# Altium project ST_TOF_Delays.PrjPCB
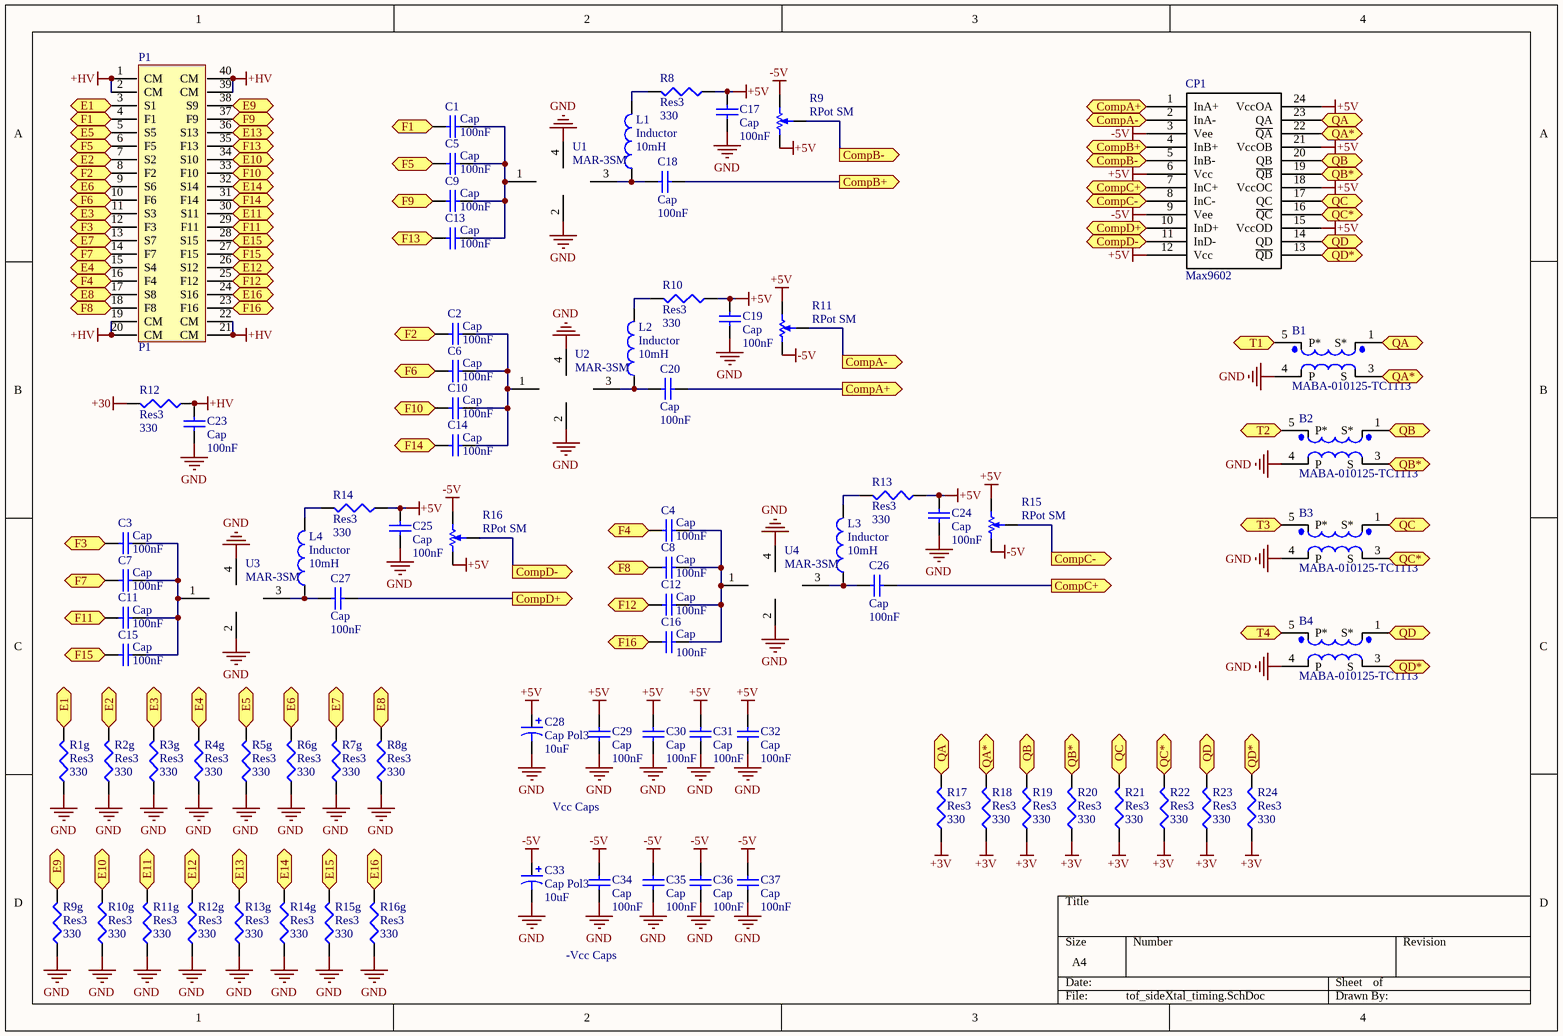
[diagram p0: tof_sideXtal_timing.SchDoc]
4 sheets, 240 parts. Net scope: flat (ports and power ports of the same name join across sheets).
Board file: tof_sideXtal_gnd_relief.PcbDoc
Sheets:
  tof_sideXtal_timing.SchDoc
  tof_sideXtal_timing2.SchDoc
  to_sideXtal_energy.SchDoc
  to_sideXtal_energy_delays.SchDoc

## Sheet tof_sideXtal_timing.SchDoc
size A4

### Parts
B1  MABA-010125-TC1113  [SM-22]
B2  MABA-010125-TC1113  [SM-22]
B3  MABA-010125-TC1113  [SM-22]
B4  MABA-010125-TC1113  [SM-22]
C1  Cap  value 100nF  [J1-0603]
C2  Cap  value 100nF  [J1-0603]
C3  Cap  value 100nF  [J1-0603]
C4  Cap  value 100nF  [J1-0603]
C5  Cap  value 100nF  [J1-0603]
C6  Cap  value 100nF  [J1-0603]
C7  Cap  value 100nF  [J1-0603]
C8  Cap  value 100nF  [J1-0603]
C9  Cap  value 100nF  [J1-0603]
C10  Cap  value 100nF  [J1-0603]
C11  Cap  value 100nF  [J1-0603]
C12  Cap  value 100nF  [J1-0603]
C13  Cap  value 100nF  [J1-0603]
C14  Cap  value 100nF  [J1-0603]
C15  Cap  value 100nF  [J1-0603]
C16  Cap  value 100nF  [J1-0603]
C17  Cap  value 100nF  [J1-0603]
C18  Cap  value 100nF  [J1-0603]
C19  Cap  value 100nF  [J1-0603]
C20  Cap  value 100nF  [J1-0603]
C23  Cap  value 100nF  [J1-0603]
C24  Cap  value 100nF  [J1-0603]
C25  Cap  value 100nF  [J1-0603]
C26  Cap  value 100nF  [J1-0603]
C27  Cap  value 100nF  [J1-0603]
C28  Cap Pol3  value 10uF  [J1-0603]
C29  Cap  value 100nF  [0402]
C30  Cap  value 100nF  [0402]
C31  Cap  value 100nF  [0402]
C32  Cap  value 100nF  [0402]
C33  Cap Pol3  value 10uF  [J1-0603]
C34  Cap  value 100nF  [0402]
C35  Cap  value 100nF  [0402]
C36  Cap  value 100nF  [0402]
C37  Cap  value 100nF  [0402]
CP1  Max9602  [TSSOP24]
L1  Inductor  value 10mH  [J1-0603]
L2  Inductor  value 10mH  [J1-0603]
L3  Inductor  value 10mH  [J1-0603]
L4  Inductor  value 10mH  [J1-0603]
P1  P1  [DS17(3.0)-40DS-0.5(0.57)]
R1g  Res3  value 330  [0402]
R2g  Res3  value 330  [0402]
R3g  Res3  value 330  [0402]
R4g  Res3  value 330  [0402]
R5g  Res3  value 330  [0402]
R6g  Res3  value 330  [0402]
R7g  Res3  value 330  [0402]
R8  Res3  value 330  [J1-0603]
R8g  Res3  value 330  [0402]
R9  RPot SM  [POT-3MM-SMD]
R9g  Res3  value 330  [0402]
R10  Res3  value 330  [J1-0603]
R10g  Res3  value 330  [0402]
R11  RPot SM  [POT-3MM-SMD]
R11g  Res3  value 330  [0402]
R12  Res3  value 330  [0402]
R12g  Res3  value 330  [0402]
R13  Res3  value 330  [J1-0603]
R13g  Res3  value 330  [0402]
R14  Res3  value 330  [J1-0603]
R14g  Res3  value 330  [0402]
R15  RPot SM  [POT-3MM-SMD]
R15g  Res3  value 330  [0402]
R16  RPot SM  [POT-3MM-SMD]
R16g  Res3  value 330  [0402]
R17  Res3  value 330  [0402]
R18  Res3  value 330  [0402]
R19  Res3  value 330  [0402]
R20  Res3  value 330  [0402]
R21  Res3  value 330  [0402]
R22  Res3  value 330  [0402]
R23  Res3  value 330  [0402]
R24  Res3  value 330  [0402]
U1  MAR-3SM  [WW107]
U2  MAR-3SM  [WW107]
U3  MAR-3SM  [WW107]
U4  MAR-3SM  [WW107]

### Ports
CompA+ (out), CompA- (out), CompB+ (out), CompB- (out), CompC+ (out), CompC- (out), CompD+ (out), CompD- (out), E1 (out), E2 (out), E3 (out), E4 (out), E5 (out), E6 (out), E7 (out), E8 (out), E9 (out), E10 (out), E11 (out), E12 (out), E13 (out), E14 (out), E15 (out), E16 (out), F1 (out), F2 (out), F3 (out), F4 (out), F5 (out), F6 (out), F7 (out), F8 (out), F9 (out), F10 (out), F11 (out), F12 (out), F13 (out), F14 (out), F15 (out), F16 (out), QA (out), QA* (out), QB (out), QB* (out), QC (out), QC* (out), QD (out), QD* (out), T1 (out), T2 (out), T3 (out), T4 (out)

### Nets
+3V: R17.1 R18.1 R19.1 R20.1 R21.1 R22.1 R23.1 R24.1
+5V: C17.1 C19.1 C24.1 C25.1 C28.1 C29.2 C30.2 C31.2 C32.2 CP1.6(Vcc) CP1.12(Vcc) CP1.15(VccOD) CP1.18(VccOC) CP1.21(VccOB) CP1.24(VccOA) R8.1 R9.CCW(-) R10.1 R11.CW(+) R13.1 R14.1 R15.CW(+) R16.CCW(-)
+30: R12.2
+HV: C23.1 P1.1(CM) P1.2(CM) P1.19(CM) P1.20(CM) P1.21(CM) P1.22(CM) P1.39(CM) P1.40(CM) R12.1
-5V: C33.1 C34.2 C35.2 C36.2 C37.2 CP1.3(Vee) CP1.9(Vee) R9.CW(+) R11.CCW(-) R15.CCW(-) R16.CW(+)
GND: B1.4(P) B2.4(P) B3.4(P) B4.4(P) C17.2 C19.2 C23.2 C24.2 C25.2 C28.2 C29.1 C30.1 C31.1 C32.1 C33.2 C34.1 C35.1 C36.1 C37.1 R1g.1 R2g.1 R3g.1 R4g.1 R5g.1 R6g.1 R7g.1 R8g.1 R9g.1 R10g.1 R11g.1 R12g.1 R13g.1 R14g.1 R15g.1 R16g.1 U1.2 U1.4 U2.2 U2.4 U3.2 U3.4 U4.2 U4.4
NetB1_1: B1.1(S*) CP1.23(QA) R17.2 ; port QA
NetB1_3: B1.3(S) CP1.22(~{QA}) R18.2 ; port QA*
NetB1_5: B1.5(P*) ; port T1
NetB2_1: B2.1(S*) CP1.20(QB) R19.2 ; port QB
NetB2_3: B2.3(S) CP1.19(~{QB}) R20.2 ; port QB*
NetB2_5: B2.5(P*) ; port T2
NetB3_1: B3.1(S*) CP1.17(QC) R21.2 ; port QC
NetB3_3: B3.3(S) CP1.16(~{QC}) R22.2 ; port QC*
NetB3_5: B3.5(P*) ; port T3
NetB4_1: B4.1(S*) CP1.14(QD) R23.2 ; port QD
NetB4_3: B4.3(S) CP1.13(~{QD}) R24.2 ; port QD*
NetB4_5: B4.5(P*) ; port T4
NetC1_1: C1.1 C5.1 C9.1 C13.1 U1.1
NetC1_2: C1.2 P1.4(F1) ; port F1
NetC2_1: C2.1 C6.1 C10.1 C14.1 U2.1
NetC2_2: C2.2 P1.8(F2) ; port F2
NetC3_1: C3.1 C7.1 C11.1 C15.1 U3.1
NetC3_2: C3.2 P1.12(F3) ; port F3
NetC4_1: C4.1 C8.1 C12.1 C16.1 U4.1
NetC4_2: C4.2 P1.16(F4) ; port F4
NetC5_2: C5.2 P1.6(F5) ; port F5
NetC6_2: C6.2 P1.10(F6) ; port F6
NetC7_2: C7.2 P1.14(F7) ; port F7
NetC8_2: C8.2 P1.18(F8) ; port F8
NetC9_2: C9.2 P1.37(F9) ; port F9
NetC10_2: C10.2 P1.33(F10) ; port F10
NetC11_2: C11.2 P1.29(F11) ; port F11
NetC12_2: C12.2 P1.25(F12) ; port F12
NetC13_2: C13.2 P1.35(F13) ; port F13
NetC14_2: C14.2 P1.31(F14) ; port F14
NetC15_2: C15.2 P1.27(F15) ; port F15
NetC16_2: C16.2 P1.23(F16) ; port F16
NetC18_1: C18.1 L1.1 U1.3
NetC18_2: C18.2 CP1.4(InB+) ; port CompB+
NetC20_1: C20.1 L2.1 U2.3
NetC20_2: C20.2 CP1.1(InA+) ; port CompA+
NetC26_1: C26.1 L3.1 U4.3
NetC26_2: C26.2 CP1.7(InC+) ; port CompC+
NetC27_1: C27.1 L4.1 U3.3
NetC27_2: C27.2 CP1.10(InD+) ; port CompD+
NetCP1_2: CP1.2(InA-) R11.W ; port CompA-
NetCP1_5: CP1.5(InB-) R9.W ; port CompB-
NetCP1_8: CP1.8(InC-) R15.W ; port CompC-
NetCP1_11: CP1.11(InD-) R16.W ; port CompD-
NetL1_2: L1.2 R8.2
NetL2_2: L2.2 R10.2
NetL3_2: L3.2 R13.2
NetL4_2: L4.2 R14.2
NetP1_3: P1.3(S1) R1g.2 ; port E1
NetP1_5: P1.5(S5) R5g.2 ; port E5
NetP1_7: P1.7(S2) R2g.2 ; port E2
NetP1_9: P1.9(S6) R6g.2 ; port E6
NetP1_11: P1.11(S3) R3g.2 ; port E3
NetP1_13: P1.13(S7) R7g.2 ; port E7
NetP1_15: P1.15(S4) R4g.2 ; port E4
NetP1_17: P1.17(S8) R8g.2 ; port E8
NetP1_24: P1.24(S16) R16g.2 ; port E16
NetP1_26: P1.26(S12) R12g.2 ; port E12
NetP1_28: P1.28(S15) R15g.2 ; port E15
NetP1_30: P1.30(S11) R11g.2 ; port E11
NetP1_32: P1.32(S14) R14g.2 ; port E14
NetP1_34: P1.34(S10) R10g.2 ; port E10
NetP1_36: P1.36(S13) R13g.2 ; port E13
NetP1_38: P1.38(S9) R9g.2 ; port E9

### Notes on the sheet
- Vcc Caps
- -Vcc Caps

### Library data of the parts
C1-C20 C23-C27 C29-C32 C34-C37 = Cap: Capacitor; Published: 8-Jun-2000; LatestRevisionDate: 17-Jul-2002; LatestRevisionNote: Re-released for DXP Platform.; PackageReference: RAD-0.3; Publisher: Altium Limited; PackageDescription: Radial Cap, Thru-Hole; 2 Leads; 0.3 in Pin Spacing
C28 C33 = Cap Pol3: Polarized Capacitor (Surface Mount); Published: 8-Jun-2000; LatestRevisionDate: 29-May-2009; LatestRevisionNote: IPC-7351 Footprint Added.; PackageReference: C0805; Publisher: Altium Limited; PackageDescription: Chip Capacitor
L1-L4 = Inductor: Code_IEC: 1005; Published: 8-Jun-2000; LatestRevisionDate: 29-May-2009; LatestRevisionNote: IPC-7351 Footprint Added.; PackageReference: 0402-A; Publisher: Altium Limited; PackageDescription: Chip Inductor; Code_JEITA: 0402
P1 = Sensl-ArrayC-30035-16P-PCB
R1g R2g R3g R4g R5g R6g R7g R8 R8g R9g R10 R10g R11g R12 R12g R13 R13g R14 R14g R15g R16g R17-R24 = Res3: Resistor; Published: 8-Jun-2000; LatestRevisionDate: 29-May-2009; LatestRevisionNote: IPC-7351 Footprint Added.; PackageReference: J1-0603; Publisher: Altium Limited; PackageDescription: Chip Resistor
R9 R11 R15 R16 = RPot SM: Square Trimming Potentiometer; Published: 17-Dec-2003; DatasheetVersion: Oct-2003; PackageReference: POT4MM-2; Publisher: Altium Limited; PackageDescription: Square Trimming Potentiometer; ComponentLink1Description: Manufacturer Link; ComponentLink1URL: http://bourns.com/2/search.html
U1-U4 = MAR-3SM+

## Sheet tof_sideXtal_timing2.SchDoc
size A4
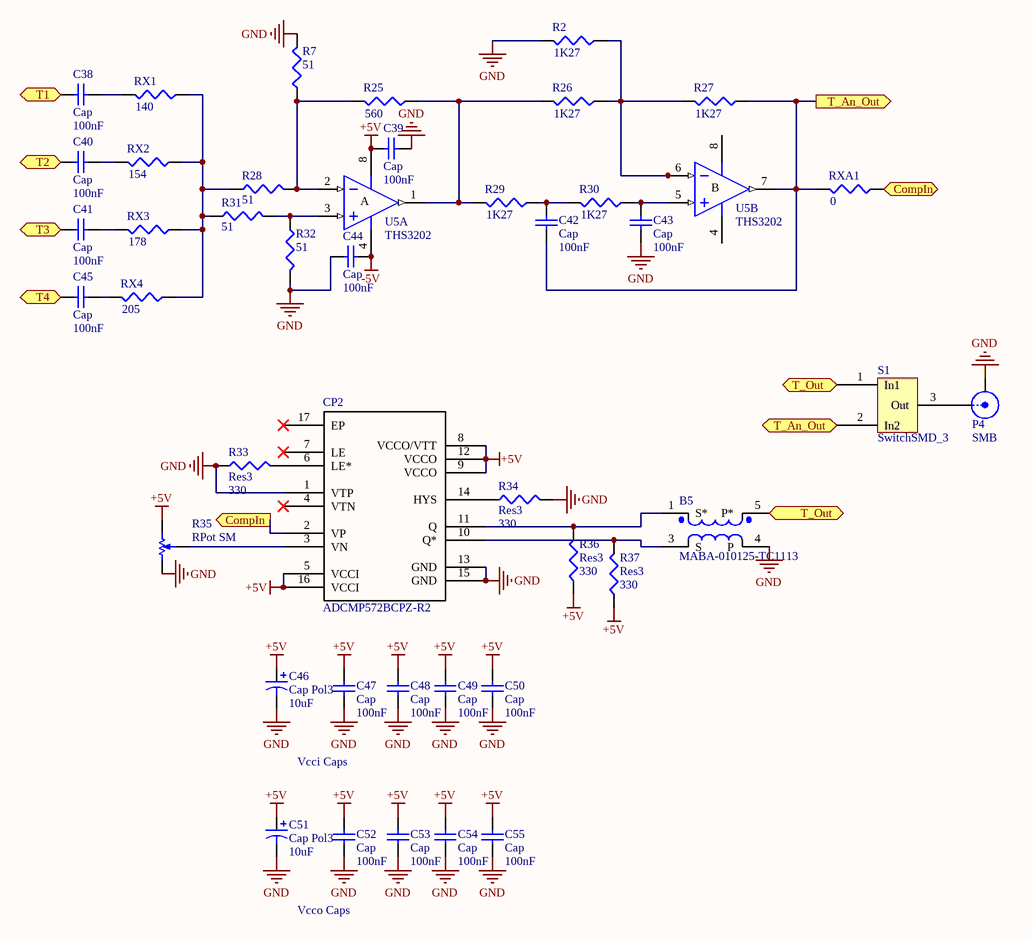
[diagram p1: tof_sideXtal_timing2.SchDoc]

### Parts
B5  MABA-010125-TC1113  [SM-22]
C38  Cap  value 100nF  [0402]
C39  Cap  value 100nF  [0402]
C40  Cap  value 100nF  [0402]
C41  Cap  value 100nF  [0402]
C42  Cap  value 100nF  [0402]
C43  Cap  value 100nF  [0402]
C44  Cap  value 100nF  [0402]
C45  Cap  value 100nF  [0402]
C46  Cap Pol3  value 10uF  [1608[0603]]
C47  Cap  value 100nF  [0402]
C48  Cap  value 100nF  [0402]
C49  Cap  value 100nF  [0402]
C50  Cap  value 100nF  [0402]
C51  Cap Pol3  value 10uF  [1608[0603]]
C52  Cap  value 100nF  [0402]
C53  Cap  value 100nF  [0402]
C54  Cap  value 100nF  [0402]
C55  Cap  value 100nF  [0402]
CP2  ADCMP572BCPZ-R2  [CP_16_3]
P4  SMB  [SMA-SMD]
R2  value 1K27  [0402]  (hidden comment: Res3)
R7  value 51  [0402]  (hidden comment: Res3)
R25  value 560  [0402]  (hidden comment: Res3)
R26  value 1K27  [0402]  (hidden comment: Res3)
R27  value 1K27  [0402]  (hidden comment: Res3)
R28  value 51  [0402]  (hidden comment: Res3)
R29  value 1K27  [0402]  (hidden comment: Res3)
R30  value 1K27  [0402]  (hidden comment: Res3)
R31  value 51  [0402]  (hidden comment: Res3)
R32  value 51  [0402]  (hidden comment: Res3)
R33  Res3  value 330  [0402]
R34  Res3  value 330  [0402]
R35  RPot SM  [POT-3MM-SMD]
R36  Res3  value 330  [0402]
R37  Res3  value 330  [0402]
RX1  value 140  [0402]  (hidden comment: Res3)
RX2  value 154  [0402]  (hidden comment: Res3)
RX3  value 178  [0402]  (hidden comment: Res3)
RX4  value 205  [0402]  (hidden comment: Res3)
RXA1  value 0  [0402]  (hidden comment: Res3)
S1  SwitchSMD_3  [SwitchSMD_0603]
U5  THS3202  [SO-8_N]  (parts A,B of 2)

### Ports
CompIn (out), T1 (out), T2 (out), T3 (out), T4 (out), T_An_Out (out), T_Out (out)

### Nets
+5V: C39.1 C46.1 C47.2 C48.2 C49.2 C50.2 C51.1 C52.2 C53.2 C54.2 C55.2 CP2.5(VCCI) CP2.8(VCCO/VTT) CP2.9(VCCO) CP2.12(VCCO) CP2.16(VCCI) R35.CW(+) R36.1 R37.1 U5.8(V+)
-5V: C44.2 U5.4(V-)
GND: B5.4(P) C39.2 C43.2 C44.1 C46.2 C47.1 C48.1 C49.1 C50.1 C51.2 C52.1 C53.1 C54.1 C55.1 CP2.1(VTP) CP2.13(GND) CP2.15(GND) P4.2(Y) R2.2 R7.2 R32.2 R33.1 R34.2 R35.CCW(-)
NetB1_5: C38.1 ; port T1
NetB2_5: C40.1 ; port T2
NetB3_5: C41.1 ; port T3
NetB4_5: C45.1 ; port T4
NetB5_1: B5.1(S*) CP2.11(Q) R36.2
NetB5_3: B5.3(S) CP2.10(Q*) R37.2
NetB5_5: B5.5(P*) S1.1(In1) ; port T_Out
NetC38_2: C38.2 RX1.2
NetC40_2: C40.2 RX2.2
NetC41_2: C41.2 RX3.2
NetC42_1: C42.1 R29.1 R30.2
NetC42_2: C42.2 R27.1 RXA1.2 S1.2(In2) U5.7(OUT) ; port T_An_Out
NetC43_1: C43.1 R30.1 U5.5(IN+)
NetC45_2: C45.2 RX4.2
NetCP2_2: CP2.2(VP) RXA1.1 ; port CompIn
NetCP2_3: CP2.3(VN) R35.W
NetCP2_6: CP2.6(LE*) R33.2
NetCP2_14: CP2.14(HYS) R34.1
NetP4_1: P4.1(X) S1.3(Out)
NetR2_1: R2.1 R26.1 R27.2 U5.6(IN-)
NetR7_1: R7.1 R25.2 R28.2 U5.2(IN-)
NetR25_1: R25.1 R26.2 R29.2 U5.1(OUT)
NetR28_1: R28.1 R31.1 RX1.1 RX2.1 RX3.1 RX4.1
NetR31_2: R31.2 R32.1 U5.3(IN+)

Not connected (* = marked no-connect by the designer): CP2 4(VTN)* 7(LE)* 17(EP)*

### Notes on the sheet
- Vcci Caps
- Vcco Caps
- (in symbol AD8002AR, part A) A
- (in symbol AD8002AR, part B) B

### Library data of the parts
C38-C45 C47-C50 C52-C55 = Cap: Capacitor; Published: 8-Jun-2000; LatestRevisionDate: 17-Jul-2002; LatestRevisionNote: Re-released for DXP Platform.; PackageReference: RAD-0.3; Publisher: Altium Limited; PackageDescription: Radial Cap, Thru-Hole; 2 Leads; 0.3 in Pin Spacing
C46 C51 = Cap Pol3: Polarized Capacitor (Surface Mount); Published: 8-Jun-2000; LatestRevisionDate: 29-May-2009; LatestRevisionNote: IPC-7351 Footprint Added.; PackageReference: C0805; Publisher: Altium Limited; PackageDescription: Chip Capacitor
CP2 = ADCMP572BCPZ-R2: Imported; Manufacturer_Part_Number: ADCMP572BCPZ-R2; Vendor: Vendor; RefDes: RefDes; Type: DEV; Value: Value
P4 = SMB: SMB Straight Connector; LatestRevisionDate: 17-Jul-2002; LatestRevisionNote: Re-released for DXP Platform.; Publisher: Altium Limited
R2 R7 R25-R34 R36 R37 RX1-RX4 RXA1 = Res3: Resistor; Published: 8-Jun-2000; LatestRevisionDate: 29-May-2009; LatestRevisionNote: IPC-7351 Footprint Added.; PackageReference: J1-0603; Publisher: Altium Limited; PackageDescription: Chip Resistor
R35 = RPot SM: Square Trimming Potentiometer; Published: 17-Dec-2003; DatasheetVersion: Oct-2003; PackageReference: POT4MM-2; Publisher: Altium Limited; PackageDescription: Square Trimming Potentiometer; ComponentLink1Description: Manufacturer Link; ComponentLink1URL: http://bourns.com/2/search.html
U5 = AD8002AR: Dual 600MHz, 50mW Current Feedback Amplifier; Published: 8-Jun-2000; LatestRevisionDate: 13-Apr-2006; LatestRevisionNote: IPC-7351 Footprint Added.; DatasheetVersion: REV. C 1999; PackageVersion: revA; PackageReference: SO-8; Publisher: Altium Limited; PackageDescription: 8-Pin Small Outline Integrated Circuit 1.27 mm Pitch; Code_JEDEC: MS-012-AA; Code_IPC: SOIC127P600-8; ComponentLink1Description: Manufacturer Link; ComponentLink1URL: http://www.analog.com/en/prod/0,,759_786_AD8002%2C00.html; ComponentLink2Description: Datasheet; ComponentLink2URL: http://www.analog.com/UploadedFiles/Data_Sheets/147523773AD8002_d.pdf

## Sheet to_sideXtal_energy.SchDoc
size A4
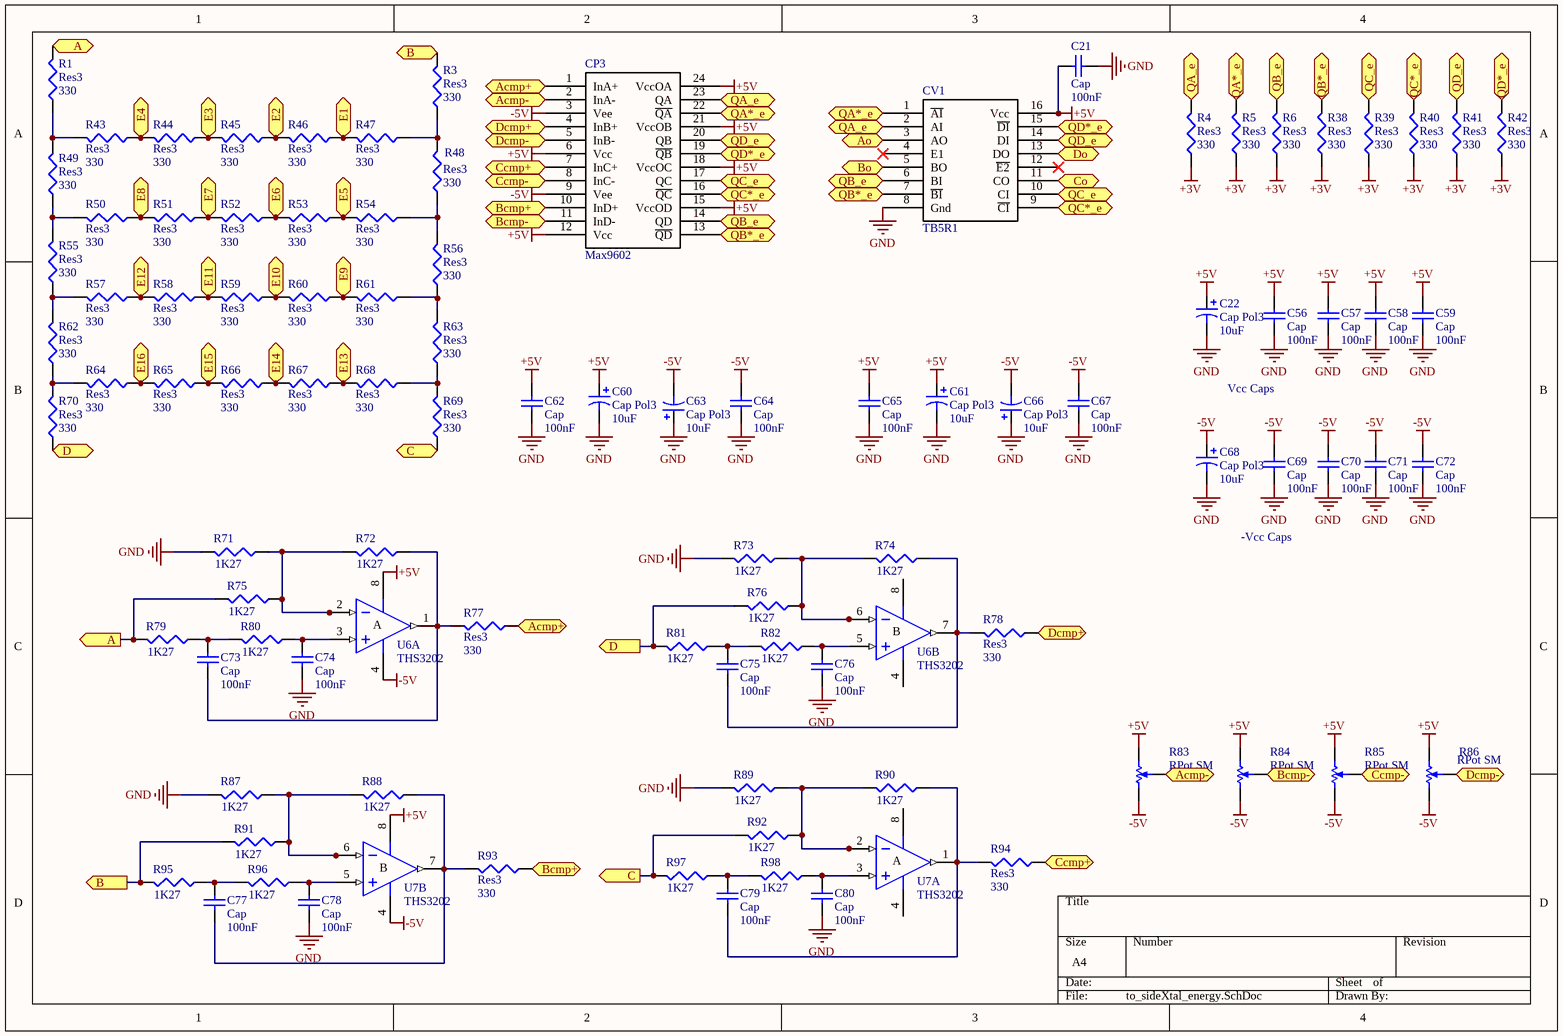
[diagram p2: to_sideXtal_energy.SchDoc]

### Parts
C21  Cap  value 100nF  [1608[0603]]
C22  Cap Pol3  value 10uF  [1608[0603]]
C56  Cap  value 100nF  [0402]
C57  Cap  value 100nF  [0402]
C58  Cap  value 100nF  [0402]
C59  Cap  value 100nF  [0402]
C60  Cap Pol3  value 10uF  [1608[0603]]
C61  Cap Pol3  value 10uF  [1608[0603]]
C62  Cap  value 100nF  [0402]
C63  Cap Pol3  value 10uF  [1608[0603]]
C64  Cap  value 100nF  [0402]
C65  Cap  value 100nF  [0402]
C66  Cap Pol3  value 10uF  [1608[0603]]
C67  Cap  value 100nF  [0402]
C68  Cap Pol3  value 10uF  [1608[0603]]
C69  Cap  value 100nF  [0402]
C70  Cap  value 100nF  [0402]
C71  Cap  value 100nF  [0402]
C72  Cap  value 100nF  [0402]
C73  Cap  value 100nF  [0402]
C74  Cap  value 100nF  [0402]
C75  Cap  value 100nF  [0402]
C76  Cap  value 100nF  [0402]
C77  Cap  value 100nF  [0402]
C78  Cap  value 100nF  [0402]
C79  Cap  value 100nF  [0402]
C80  Cap  value 100nF  [0402]
CP3  Max9602  [TSSOP24]
CV1  TB5R1  [SOIC16_N]
R1  Res3  value 330  [0402]
R3  Res3  value 330  [0402]
R4  Res3  value 330  [0402]
R5  Res3  value 330  [0402]
R6  Res3  value 330  [0402]
R38  Res3  value 330  [0402]
R39  Res3  value 330  [0402]
R40  Res3  value 330  [0402]
R41  Res3  value 330  [0402]
R42  Res3  value 330  [0402]
R43  Res3  value 330  [0402]
R44  Res3  value 330  [0402]
R45  Res3  value 330  [0402]
R46  Res3  value 330  [0402]
R47  Res3  value 330  [0402]
R48  Res3  value 330  [0402]
R49  Res3  value 330  [0402]
R50  Res3  value 330  [0402]
R51  Res3  value 330  [0402]
R52  Res3  value 330  [0402]
R53  Res3  value 330  [0402]
R54  Res3  value 330  [0402]
R55  Res3  value 330  [0402]
R56  Res3  value 330  [0402]
R57  Res3  value 330  [0402]
R58  Res3  value 330  [0402]
R59  Res3  value 330  [0402]
R60  Res3  value 330  [0402]
R61  Res3  value 330  [0402]
R62  Res3  value 330  [0402]
R63  Res3  value 330  [0402]
R64  Res3  value 330  [0402]
R65  Res3  value 330  [0402]
R66  Res3  value 330  [0402]
R67  Res3  value 330  [0402]
R68  Res3  value 330  [0402]
R69  Res3  value 330  [0402]
R70  Res3  value 330  [0402]
R71  value 1K27  [0402]  (hidden comment: Res3)
R72  value 1K27  [0402]  (hidden comment: Res3)
R73  value 1K27  [0402]  (hidden comment: Res3)
R74  value 1K27  [0402]  (hidden comment: Res3)
R75  value 1K27  [0402]  (hidden comment: Res3)
R76  value 1K27  [0402]  (hidden comment: Res3)
R77  Res3  value 330  [0402]
R78  Res3  value 330  [0402]
R79  value 1K27  [0402]  (hidden comment: Res3)
R80  value 1K27  [0402]  (hidden comment: Res3)
R81  value 1K27  [0402]  (hidden comment: Res3)
R82  value 1K27  [0402]  (hidden comment: Res3)
R83  RPot SM  [POT-3MM-SMD]
R84  RPot SM  [POT-3MM-SMD]
R85  RPot SM  [POT-3MM-SMD]
R86  RPot SM  [POT-3MM-SMD]
R87  value 1K27  [0402]  (hidden comment: Res3)
R88  value 1K27  [0402]  (hidden comment: Res3)
R89  value 1K27  [0402]  (hidden comment: Res3)
R90  value 1K27  [0402]  (hidden comment: Res3)
R91  value 1K27  [0402]  (hidden comment: Res3)
R92  value 1K27  [0402]  (hidden comment: Res3)
R93  Res3  value 330  [0402]
R94  Res3  value 330  [0402]
R95  value 1K27  [0402]  (hidden comment: Res3)
R96  value 1K27  [0402]  (hidden comment: Res3)
R97  value 1K27  [0402]  (hidden comment: Res3)
R98  value 1K27  [0402]  (hidden comment: Res3)
U6  THS3202  [R-8D_N]  (parts A,B of 2)
U7  THS3202  [R-8D_N]  (parts A,B of 2)

### Ports
A (out), Acmp+ (out), Acmp- (out), Ao (out), B (out), Bcmp+ (out), Bcmp- (out), Bo (out), C (out), Ccmp+ (out), Ccmp- (out), Co (out), D (out), Dcmp+ (out), Dcmp- (out), Do (out), E1 (out), E2 (out), E3 (out), E4 (out), E5 (out), E6 (out), E7 (out), E8 (out), E9 (out), E10 (out), E11 (out), E12 (out), E13 (out), E14 (out), E15 (out), E16 (out), QA*_e (out), QA_e (out), QB*_e (out), QB_e (out), QC*_e (out), QC_e (out), QD*_e (out), QD_e (out)

### Nets
+3V: R4.1 R5.1 R6.1 R38.1 R39.1 R40.1 R41.1 R42.1
+5V: C21.1 C22.1 C56.2 C57.2 C58.2 C59.2 C60.1 C61.1 C62.1 C65.1 CP3.6(Vcc) CP3.12(Vcc) CP3.15(VccOD) CP3.18(VccOC) CP3.21(VccOB) CP3.24(VccOA) CV1.16(Vcc) R83.CW(+) R84.CW(+) R85.CW(+) R86.CW(+) U6.8(V+) U7.8(V+)
-5V: C63.2 C64.1 C66.2 C67.1 C68.1 C69.2 C70.2 C71.2 C72.2 CP3.3(Vee) CP3.9(Vee) R83.CCW(-) R84.CCW(-) R85.CCW(-) R86.CCW(-) U6.4(V-) U7.4(V-)
GND: C21.2 C22.2 C56.1 C57.1 C58.1 C59.1 C60.2 C61.2 C62.2 C63.1 C64.2 C65.2 C66.1 C67.2 C68.2 C69.1 C70.1 C71.1 C72.1 C74.2 C76.2 C78.2 C80.2 CV1.8(Gnd) R71.2 R73.2 R87.2 R89.2
NetC73_1: C73.1 R79.1 R80.2
NetC73_2: C73.2 R72.1 R77.2 U6.1(OUT)
NetC74_1: C74.1 R80.1 U6.3(IN+)
NetC75_1: C75.1 R81.1 R82.2
NetC75_2: C75.2 R74.1 R78.2 U6.7(OUT)
NetC76_1: C76.1 R82.1 U6.5(IN+)
NetC77_1: C77.1 R95.1 R96.2
NetC77_2: C77.2 R88.1 R93.2 U7.7(OUT)
NetC78_1: C78.1 R96.1 U7.5(IN+)
NetC79_1: C79.1 R97.1 R98.2
NetC79_2: C79.2 R90.1 R94.2 U7.1(OUT)
NetC80_1: C80.1 R98.1 U7.3(IN+)
NetCC1_2: CV1.3(AO) ; port Ao
NetCP3_1: CP3.1(InA+) R77.1 ; port Acmp+
NetCP3_2: CP3.2(InA-) R83.W ; port Acmp-
NetCP3_4: CP3.4(InB+) R78.1 ; port Dcmp+
NetCP3_5: CP3.5(InB-) R86.W ; port Dcmp-
NetCP3_7: CP3.7(InC+) R94.1 ; port Ccmp+
NetCP3_8: CP3.8(InC-) R85.W ; port Ccmp-
NetCP3_10: CP3.10(InD+) R93.1 ; port Bcmp+
NetCP3_11: CP3.11(InD-) R84.W ; port Bcmp-
NetCP3_13: CP3.13(~{QD}) CV1.7(~{BI}) R38.2 ; port QB*_e
NetCP3_14: CP3.14(QD) CV1.6(BI) R6.2 ; port QB_e
NetCP3_16: CP3.16(~{QC}) CV1.9(~{CI}) R40.2 ; port QC*_e
NetCP3_17: CP3.17(QC) CV1.10(CI) R39.2 ; port QC_e
NetCP3_19: CP3.19(~{QB}) CV1.15(~{DI}) R42.2 ; port QD*_e
NetCP3_20: CP3.20(QB) CV1.14(DI) R41.2 ; port QD_e
NetCP3_22: CP3.22(~{QA}) CV1.1(~{AI}) R5.2 ; port QA*_e
NetCP3_23: CP3.23(QA) CV1.2(AI) R4.2 ; port QA_e
NetCV1_5: CV1.5(BO) ; port Bo
NetCV1_11: CV1.11(CO) ; port Co
NetCV1_13: CV1.13(DO) ; port Do
NetP1_3: R46.1 R47.2 ; port E1
NetP1_5: R53.1 R54.2 ; port E5
NetP1_7: R45.1 R46.2 ; port E2
NetP1_9: R52.1 R53.2 ; port E6
NetP1_11: R44.1 R45.2 ; port E3
NetP1_13: R51.1 R52.2 ; port E7
NetP1_15: R43.1 R44.2 ; port E4
NetP1_17: R50.1 R51.2 ; port E8
NetP1_24: R64.1 R65.2 ; port E16
NetP1_26: R57.1 R58.2 ; port E12
NetP1_28: R65.1 R66.2 ; port E15
NetP1_30: R58.1 R59.2 ; port E11
NetP1_32: R66.1 R67.2 ; port E14
NetP1_34: R59.1 R60.2 ; port E10
NetP1_36: R67.1 R68.2 ; port E13
NetP1_38: R60.1 R61.2 ; port E9
NetR1_1: R1.1 R43.2 R49.2
NetR1_2: R1.2 R75.2 R79.2 ; port A
NetR3_1: R3.1 R47.1 R48.2
NetR3_2: R3.2 R91.2 R95.2 ; port B
NetR48_1: R48.1 R54.1 R56.2
NetR49_1: R49.1 R50.2 R55.2
NetR55_1: R55.1 R57.2 R62.2
NetR56_1: R56.1 R61.1 R63.2
NetR62_1: R62.1 R64.2 R70.2
NetR63_1: R63.1 R68.1 R69.2
NetR69_1: R69.1 R92.2 R97.2 ; port C
NetR70_1: R70.1 R76.2 R81.2 ; port D
NetR71_1: R71.1 R72.2 R75.1 U6.2(IN-)
NetR73_1: R73.1 R74.2 R76.1 U6.6(IN-)
NetR87_1: R87.1 R88.2 R91.1 U7.6(IN-)
NetR89_1: R89.1 R90.2 R92.1 U7.2(IN-)

Not connected (* = marked no-connect by the designer): CV1 4(E1)* 12(~{E2})*

### Notes on the sheet
- Vcc Caps
- -Vcc Caps
- (in symbol AD8002AR, part A) A
- (in symbol AD8002AR, part B) B

### Library data of the parts
C21 C56-C59 C62 C64 C65 C67 C69-C80 = Cap: Capacitor; Published: 8-Jun-2000; LatestRevisionDate: 17-Jul-2002; LatestRevisionNote: Re-released for DXP Platform.; PackageReference: RAD-0.3; Publisher: Altium Limited; PackageDescription: Radial Cap, Thru-Hole; 2 Leads; 0.3 in Pin Spacing
C22 C60 C61 C63 C66 C68 = Cap Pol3: Polarized Capacitor (Surface Mount); Published: 8-Jun-2000; LatestRevisionDate: 29-May-2009; LatestRevisionNote: IPC-7351 Footprint Added.; PackageReference: C0805; Publisher: Altium Limited; PackageDescription: Chip Capacitor
R1 R3-R6 R38-R82 R87-R98 = Res3: Resistor; Published: 8-Jun-2000; LatestRevisionDate: 29-May-2009; LatestRevisionNote: IPC-7351 Footprint Added.; PackageReference: J1-0603; Publisher: Altium Limited; PackageDescription: Chip Resistor
R83-R86 = RPot SM: Square Trimming Potentiometer; Published: 17-Dec-2003; DatasheetVersion: Oct-2003; PackageReference: POT4MM-2; Publisher: Altium Limited; PackageDescription: Square Trimming Potentiometer; ComponentLink1Description: Manufacturer Link; ComponentLink1URL: http://bourns.com/2/search.html
U6 U7 = AD8002AR: as U5 on sheet tof_sideXtal_timing2; Published: 8-Jun-2000; LatestRevisionDate: 13-Apr-2006; LatestRevisionNote: IPC-7351 Footprint Added.; DatasheetVersion: REV. C 1999; PackageVersion: revA; PackageReference: SO-8; Publisher: Altium Limited; PackageDescription: 8-Pin Small Outline Integrated Circuit 1.27 mm Pitch; Code_JEDEC: MS-012-AA; Code_IPC: SOIC127P600-8; ComponentLink1Description: Manufacturer Link; ComponentLink1URL: http://www.analog.com/en/prod/0,,759_786_AD8002%2C00.html; ComponentLink2Description: Datasheet; ComponentLink2URL: http://www.analog.com/UploadedFiles/Data_Sheets/147523773AD8002_d.pdf

## Sheet to_sideXtal_energy_delays.SchDoc
size A4
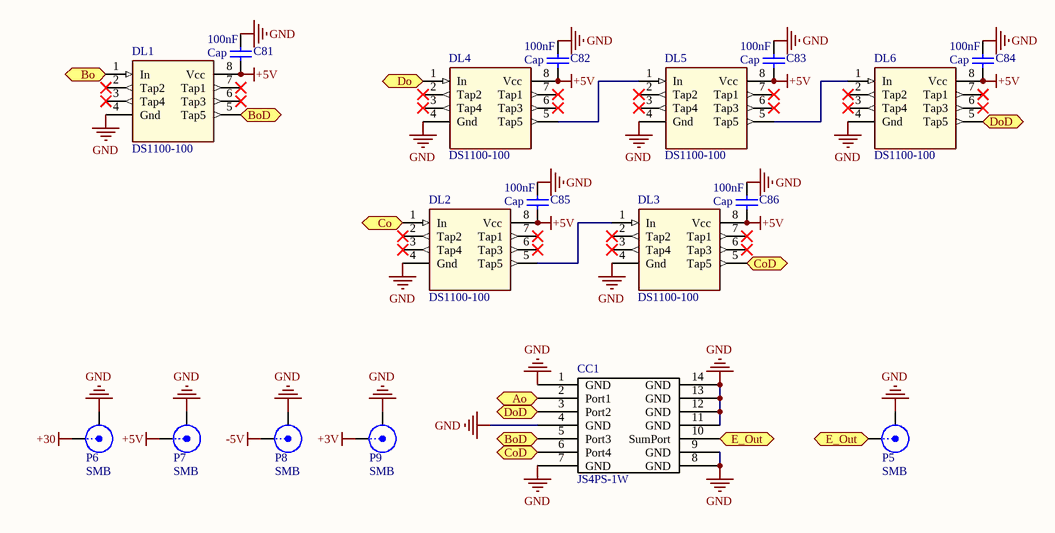
[diagram p3: to_sideXtal_energy_delays.SchDoc]

### Parts
C81  Cap  value 100nF  [0402]
C82  Cap  value 100nF  [0402]
C83  Cap  value 100nF  [0402]
C84  Cap  value 100nF  [0402]
C85  Cap  value 100nF  [0402]
C86  Cap  value 100nF  [0402]
CC1  JS4PS-1W  [JS4PS-1W]
DL1  DS1100-100  [SO8_N]
DL2  DS1100-100  [SO8_N]
DL3  DS1100-100  [SO8_N]
DL4  DS1100-100  [SO8_N]
DL5  DS1100-100  [SO8_N]
DL6  DS1100-100  [SO8_N]
P5  SMB  [SMA-SMD]
P6  SMB  [MHDR1X2]
P7  SMB  [SMA-SMD]
P8  SMB  [SMA-SMD]
P9  SMB  [SMA-SMD]

### Ports
Ao (out), Bo (out), BoD (out), Co (out), CoD (out), Do (out), DoD (out), E_Out (out)

### Nets
+3V: P9.1(X)
+5V: C81.2 C82.2 C83.2 C84.2 C85.2 C86.2 DL1.8(Vcc) DL2.8(Vcc) DL3.8(Vcc) DL4.8(Vcc) DL5.8(Vcc) DL6.8(Vcc) P7.1(X)
+30: P6.1(X)
-5V: P8.1(X)
GND: C81.1 C82.1 C83.1 C84.1 C85.1 C86.1 CC1.1(GND) CC1.4(GND) CC1.7(GND) CC1.8(GND) CC1.9(GND) CC1.11(GND) CC1.12(GND) CC1.13(GND) CC1.14(GND) DL1.4(Gnd) DL2.4(Gnd) DL3.4(Gnd) DL4.4(Gnd) DL5.4(Gnd) DL6.4(Gnd) P5.2(Y) P6.2(Y) P7.2(Y) P8.2(Y) P9.2(Y)
NetCC1_2: CC1.2(Port1) ; port Ao
NetCC1_3: CC1.3(Port2) DL6.5(Tap5) ; port DoD
NetCC1_5: CC1.5(Port3) DL1.5(Tap5) ; port BoD
NetCC1_6: CC1.6(Port4) DL3.5(Tap5) ; port CoD
NetCC1_10: CC1.10(SumPort) P5.1(X) ; port E_Out
NetCV1_5: DL1.1(In) ; port Bo
NetCV1_11: DL2.1(In) ; port Co
NetCV1_13: DL4.1(In) ; port Do
NetDL2_5: DL2.5(Tap5) DL3.1(In)
NetDL4_5: DL4.5(Tap5) DL5.1(In)
NetDL5_5: DL5.5(Tap5) DL6.1(In)

Not connected (* = marked no-connect by the designer): DL1 2(Tap2)* 3(Tap4)* 6(Tap3)* 7(Tap1)*; DL2 2(Tap2)* 3(Tap4)* 6(Tap3)* 7(Tap1)*; DL3 2(Tap2)* 3(Tap4)* 6(Tap3)* 7(Tap1)*; DL4 2(Tap2)* 3(Tap4)* 6(Tap3)* 7(Tap1)*; DL5 2(Tap2)* 3(Tap4)* 6(Tap3)* 7(Tap1)*; DL6 2(Tap2)* 3(Tap4)* 6(Tap3)* 7(Tap1)*

### Library data of the parts
C81-C86 = Cap: Capacitor; Published: 8-Jun-2000; LatestRevisionDate: 17-Jul-2002; LatestRevisionNote: Re-released for DXP Platform.; PackageReference: RAD-0.3; Publisher: Altium Limited; PackageDescription: Radial Cap, Thru-Hole; 2 Leads; 0.3 in Pin Spacing
DL1-DL6 = DS1100-500
P5-P9 = SMB: SMB Straight Connector; LatestRevisionDate: 17-Jul-2002; LatestRevisionNote: Re-released for DXP Platform.; Publisher: Altium Limited

## Nets that join several sheets
+3V: tof_sideXtal_timing (8 pins), to_sideXtal_energy (8 pins), to_sideXtal_energy_delays (P9.1)
+5V: tof_sideXtal_timing (23 pins), tof_sideXtal_timing2 (20 pins), to_sideXtal_energy (23 pins), to_sideXtal_energy_delays (13 pins)
+30: tof_sideXtal_timing (R12.2), to_sideXtal_energy_delays (P6.1)
-5V: tof_sideXtal_timing (11 pins), tof_sideXtal_timing2 (C44.2 U5.4), to_sideXtal_energy (17 pins), to_sideXtal_energy_delays (P8.1)
GND: tof_sideXtal_timing (43 pins), tof_sideXtal_timing2 (24 pins), to_sideXtal_energy (28 pins), to_sideXtal_energy_delays (26 pins)
NetB1_5: tof_sideXtal_timing (B1.5), tof_sideXtal_timing2 (C38.1)
NetB2_5: tof_sideXtal_timing (B2.5), tof_sideXtal_timing2 (C40.1)
NetB3_5: tof_sideXtal_timing (B3.5), tof_sideXtal_timing2 (C41.1)
NetB4_5: tof_sideXtal_timing (B4.5), tof_sideXtal_timing2 (C45.1)
NetCC1_2: to_sideXtal_energy (CV1.3), to_sideXtal_energy_delays (CC1.2)
NetCV1_5: to_sideXtal_energy (CV1.5), to_sideXtal_energy_delays (DL1.1)
NetCV1_11: to_sideXtal_energy (CV1.11), to_sideXtal_energy_delays (DL2.1)
NetCV1_13: to_sideXtal_energy (CV1.13), to_sideXtal_energy_delays (DL4.1)
NetP1_3: tof_sideXtal_timing (P1.3 R1g.2), to_sideXtal_energy (R46.1 R47.2)
NetP1_5: tof_sideXtal_timing (P1.5 R5g.2), to_sideXtal_energy (R53.1 R54.2)
NetP1_7: tof_sideXtal_timing (P1.7 R2g.2), to_sideXtal_energy (R45.1 R46.2)
NetP1_9: tof_sideXtal_timing (P1.9 R6g.2), to_sideXtal_energy (R52.1 R53.2)
NetP1_11: tof_sideXtal_timing (P1.11 R3g.2), to_sideXtal_energy (R44.1 R45.2)
NetP1_13: tof_sideXtal_timing (P1.13 R7g.2), to_sideXtal_energy (R51.1 R52.2)
NetP1_15: tof_sideXtal_timing (P1.15 R4g.2), to_sideXtal_energy (R43.1 R44.2)
NetP1_17: tof_sideXtal_timing (P1.17 R8g.2), to_sideXtal_energy (R50.1 R51.2)
NetP1_24: tof_sideXtal_timing (P1.24 R16g.2), to_sideXtal_energy (R64.1 R65.2)
NetP1_26: tof_sideXtal_timing (P1.26 R12g.2), to_sideXtal_energy (R57.1 R58.2)
NetP1_28: tof_sideXtal_timing (P1.28 R15g.2), to_sideXtal_energy (R65.1 R66.2)
NetP1_30: tof_sideXtal_timing (P1.30 R11g.2), to_sideXtal_energy (R58.1 R59.2)
NetP1_32: tof_sideXtal_timing (P1.32 R14g.2), to_sideXtal_energy (R66.1 R67.2)
NetP1_34: tof_sideXtal_timing (P1.34 R10g.2), to_sideXtal_energy (R59.1 R60.2)
NetP1_36: tof_sideXtal_timing (P1.36 R13g.2), to_sideXtal_energy (R67.1 R68.2)
NetP1_38: tof_sideXtal_timing (P1.38 R9g.2), to_sideXtal_energy (R60.1 R61.2)